# EAGLE schematic AnalogModule-0.2 (EAGLE 7.6.0)
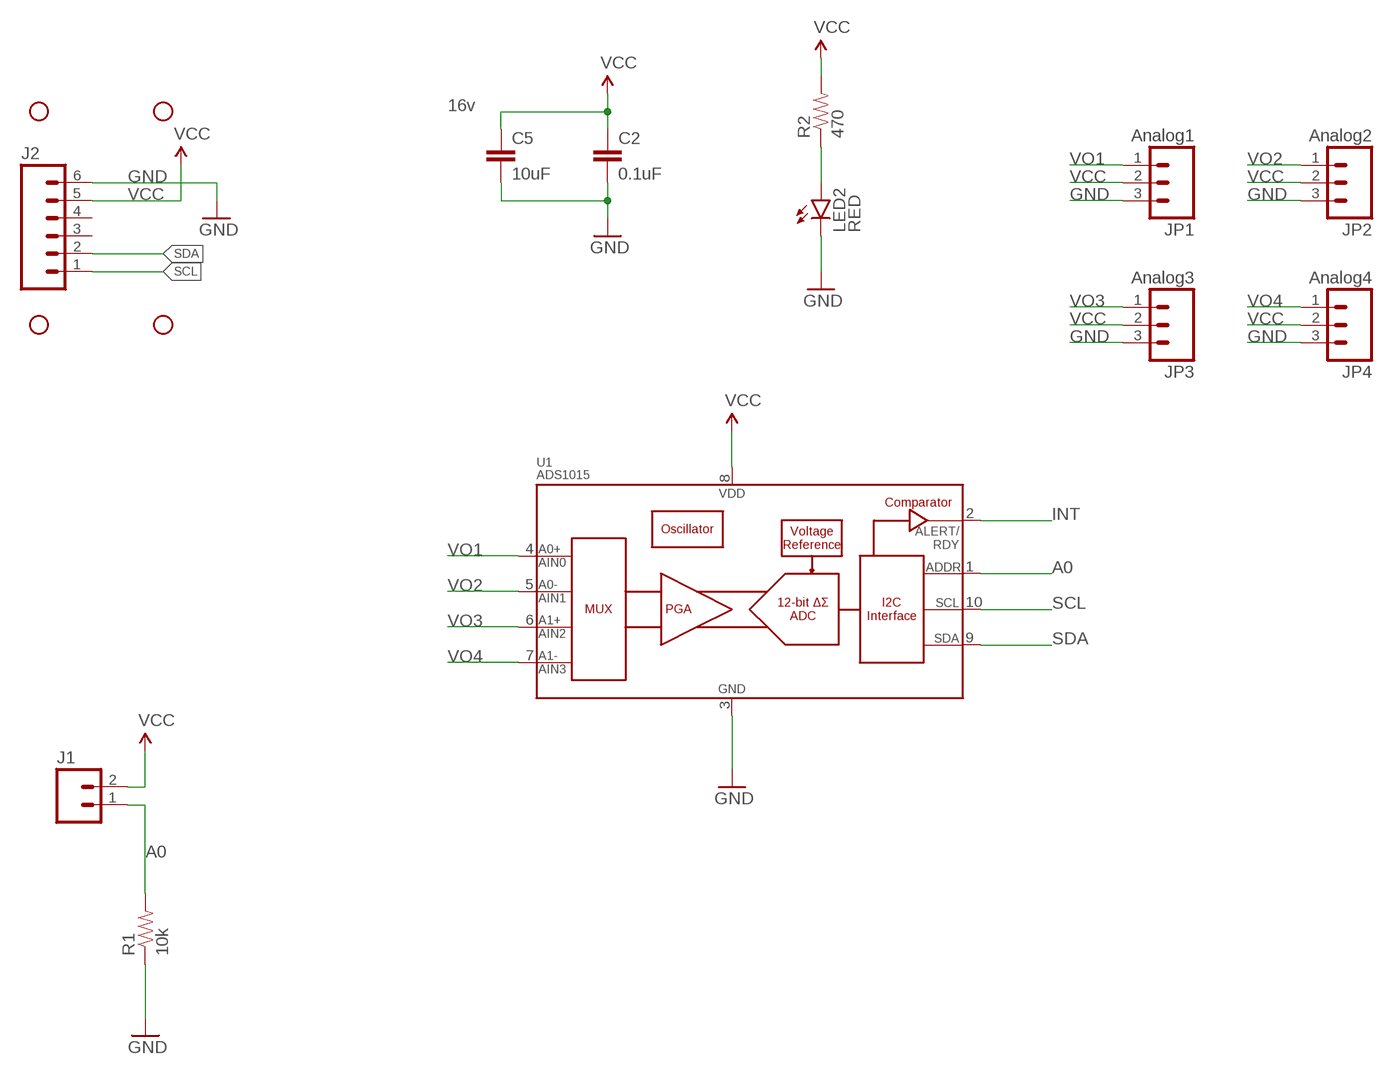
[diagram p0: schematic, sheet 1]

## Parts
C2  0.1uF  CAP0603-CAP  [0603-CAP]
C5  10uF  CAP0805  [0805]
H1  STAND-OFFPLATED  [STAND-OFF-PLATED]
H2  STAND-OFFPLATED  [STAND-OFF-PLATED]
H3  STAND-OFFPLATED  [STAND-OFF-PLATED]
H4  STAND-OFFPLATED  [STAND-OFF-PLATED]
J1  M02PTH  [1X02]
J2  M06RJ11  [RJ11-6P6C]
JP1  Analog1  M03JST-PTH-VERT  [JST-3-PTH-VERT]
JP2  Analog2  M03JST-PTH-VERT  [JST-3-PTH-VERT]
JP3  Analog3  M03JST-PTH-VERT  [JST-3-PTH-VERT]
JP4  Analog4  M03JST-PTH-VERT  [JST-3-PTH-VERT]
LED2  RED  LED-RED0603  [LED-0603]
R1  10k  RESISTOR0603  [0603-RES]
R2  470  RESISTOR0603  [0603-RES]
U1  ADS1015  [MSOP10]

## Nets
A0: J1.1 R1.2 U1.1(ADDR)
GND: C2.2 C5.2 J2.6 JP1.3 JP2.3 JP3.3 JP4.3 LED2.C R1.1 U1.3(VSS)
INT: U1.2(ALERT/RDY)
N$1: LED2.A R2.1
SCL: J2.1 U1.10(SCL)
SDA: J2.2 U1.9(SDA)
VCC: C2.1 C5.1 J1.2 J2.5 JP1.2 JP2.2 JP3.2 JP4.2 R2.2 U1.8(VDD)
VO1: JP1.1 U1.4(AIN0)
VO2: JP2.1 U1.5(AIN1)
VO3: JP3.1 U1.6(AIN2)
VO4: JP4.1 U1.7(AIN3)
Unconnected: J2.3 J2.4

## Notes on the sheet
- 16v

## Library data of the parts
C2 C5 = SparkFun-Capacitors:CAP: Capacitor Standard 0603 ceramic capacitor, and 0.1" leaded capacitor.
H1-H4 = Robotois:STAND-OFF: #4 Stand Off This is the mechanical footprint for a #4 phillips button head screw. Use the keepout ring to avoid running the screw head into surrounding components. SKU : PRT-00447
J1 = Robotois:M02: Standard 2-pin 0.1" header. Use with - straight break away headers ( PRT-00116) - right angle break away headers (PRT-00553) - swiss pins (PRT-00743) - machine pins (PRT-00117) - female headers (PRT-00115) Molex polarized connector foot print use with: PRT-08233 with associated crimp pins and housings. 2.54_SCREWTERM for use with PRT-10571. 3.5mm Screw Terminal footprints for PRT-08084 5mm Screw Terminal footprints for use with PRT-08432
J2 = Robotois:M06: Header 6 Standard 6-pin 0.1" header. Use with straight break away headers (SKU : PRT-00116), right angle break away headers (PRT-00553), swiss pins (PRT-00743), machine pins (PRT-00117), and female headers (PRT-00115). Molex polarized connector foot print use with SKU : PRT-08094 with associated crimp pins and housings. NOTES ON THE VARIANTS LOCK and LOCK_LONGPADS... This footprint was designed to help hold the alignment of a through-hole component (i.e. 6-pin header) while soldering it into place. You may notice that each hole has been shifted either up or down by 0.005 of an inch from it's more standard position (which is a perfectly straight line). This slight alteration caused the pins (the squares in the middle) to touch the edges of the holes. Because they are alternating, it causes a "brace" to hold the component in place. 0.005 has proven to be the perfect amount of "off-center" position when using our standard breakaway headers. Although looks a little odd when you look at the bare footprint, once you have a header in there, the alteration is very hard to notice. Also,if you push a header all the way into place, it is covered up entirely on the bottom side. This idea of altering the position of holes to aid alignment will be further integrated into the Sparkfun Library for other footprints. It can help hold any component with 3 or more connection pins.
JP1-JP4 = Robotois:M03: Header 3 Standard 3-pin 0.1" header. Use with straight break away headers (SKU : PRT-00116), right angle break away headers (PRT-00553), swiss pins (PRT-00743), machine pins (PRT-00117), and female headers (PRT-00115). Molex polarized connector foot print use with SKU : PRT-08232 with associated crimp pins and housings.
LED2 = SparkFun-LED:LED-RED: Assorted Red LEDs LilyPad 1206- DIO-09912 1206- DIO-00809 0603- DIO-00819 "SMART" means more efficient and expensive; PROD_ID: DIO-00819
R1 R2 = SparkFun-Resistors:RESISTOR: Resistor Basic schematic elements and footprints for 0603, 1206, and PTH resistors.
U1 = SparkFun-AnalogIC:ADS1015: 12-Bit Del-Sig ADC Four single-ended inputs or two differential inputs Internal PGA I2C interface 2.0-5.5V; PROD_ID: IC-12239